# EAGLE design rev0.1 (EAGLE 8.3.1)

## Sheet 1 of 2
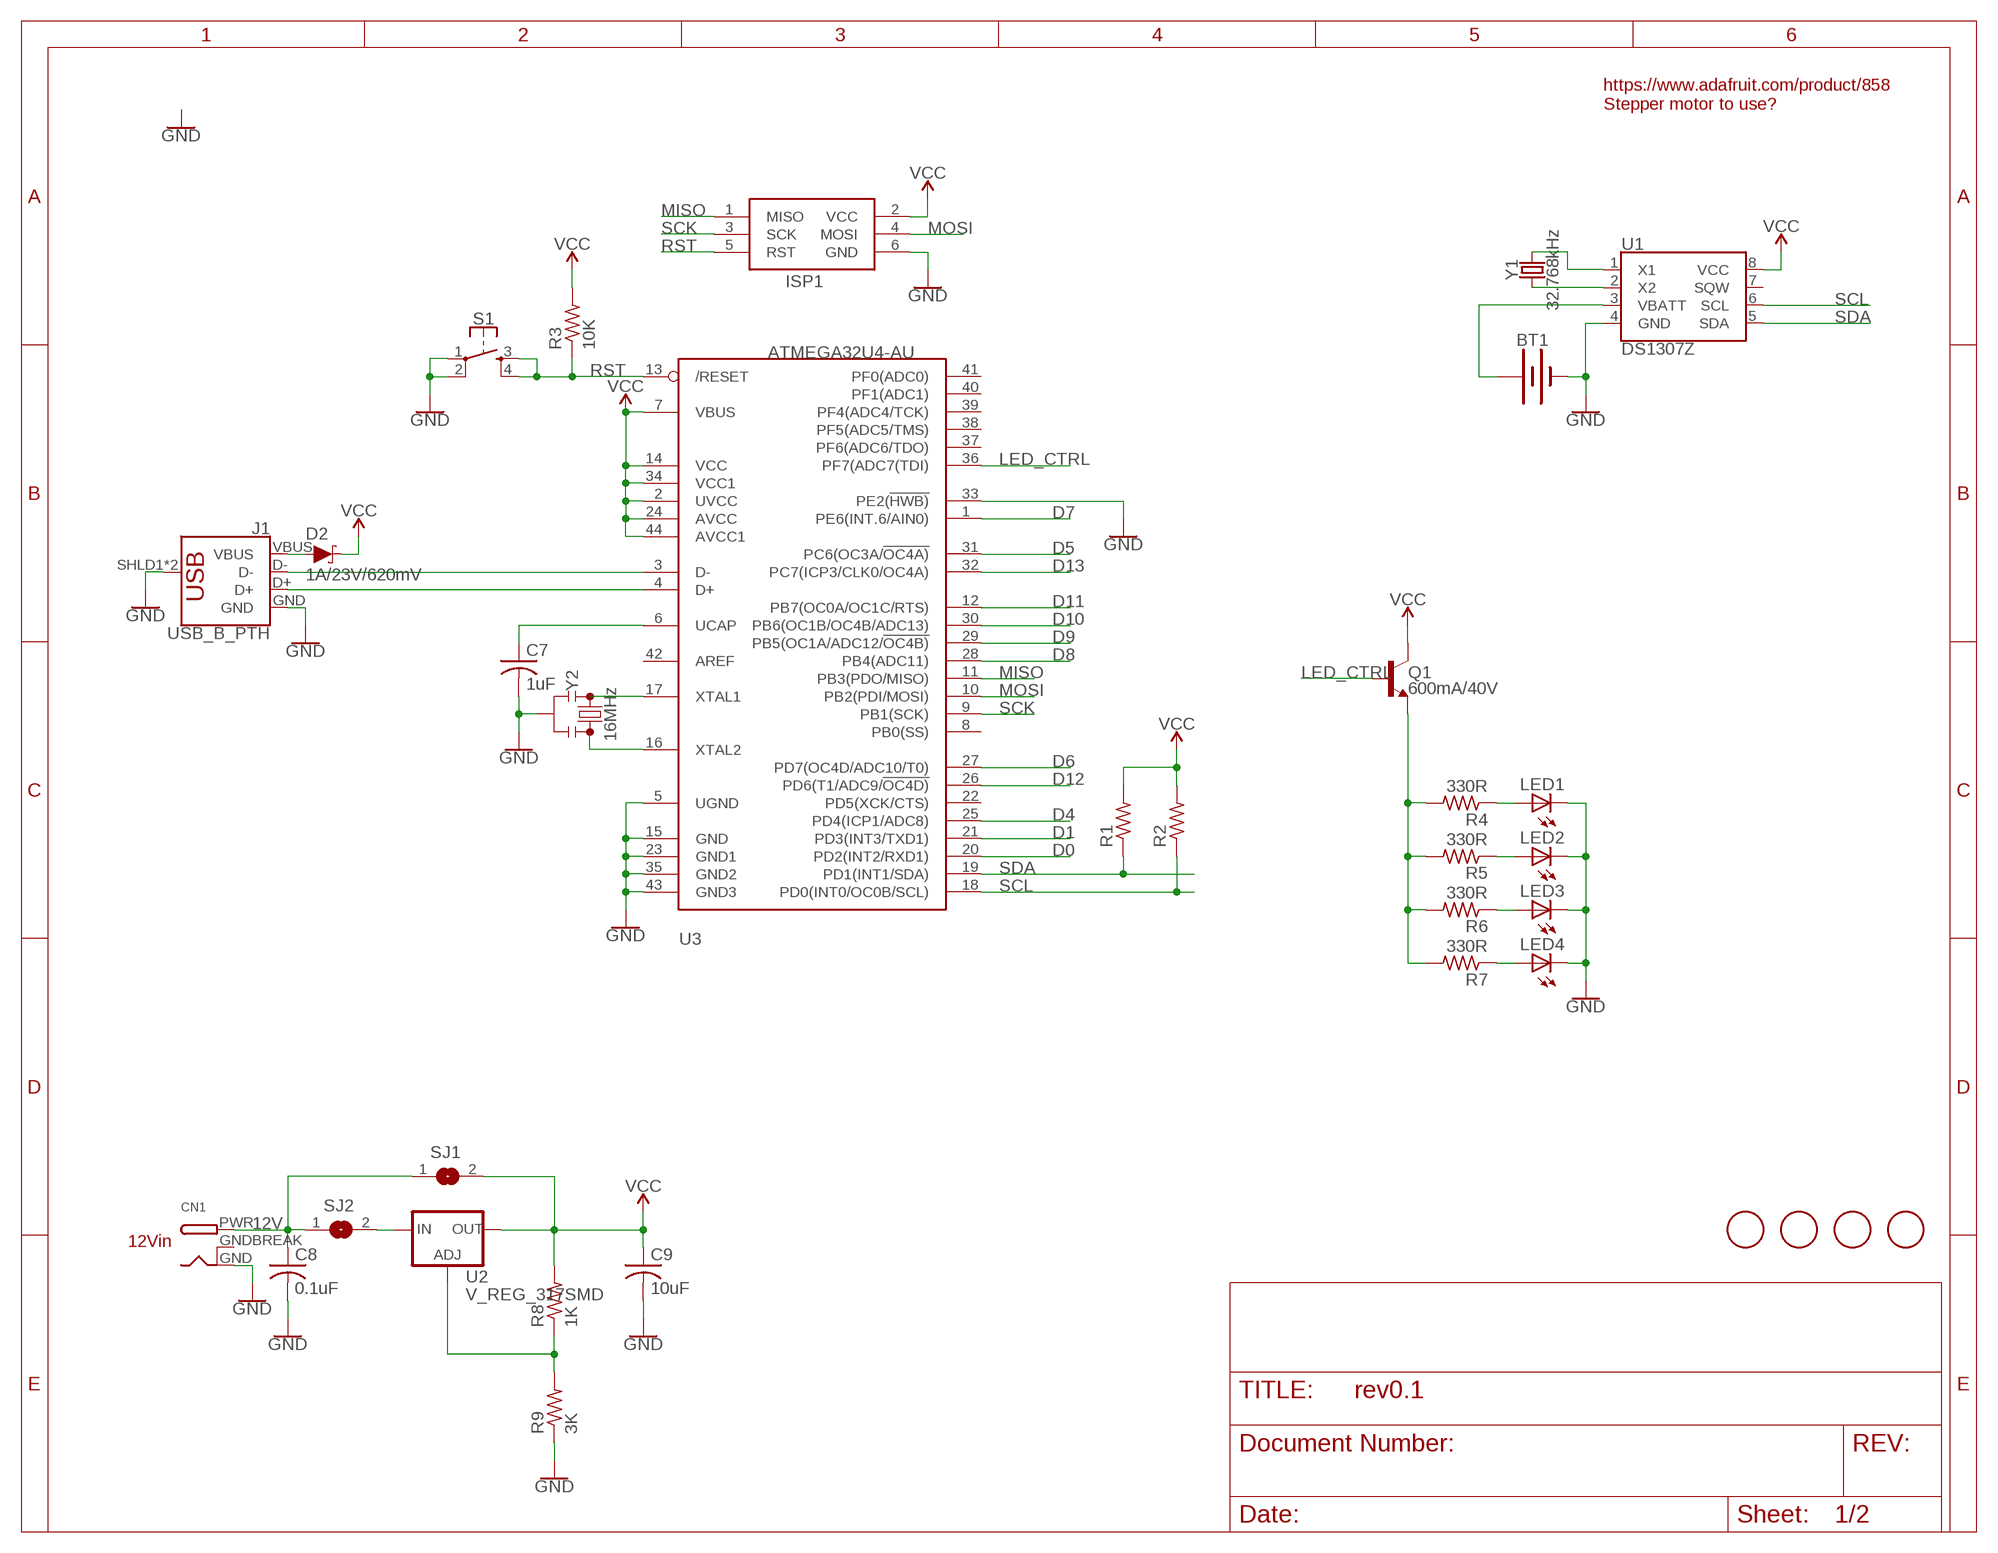
[diagram p0: schematic, sheet 1]

### Parts
BT1  BATTERY-12MM_SMD  [BATTCON_12MM]
C7  1uF  C-USC0805  [C0805]
C8  0.1uF  C-USC0805  [C0805]
C9  10uF  C-USC0805  [C0805]
CN1  DCBARRELPTH  [DCJACK_2MM_PTH]
D2  1A/23V/620mV  DIODE-SCHOTTKY-BAT20J  [SOD-323]
ISP1  AVRISP-6  [AVRISP]
J1  USB_B_PTH  [USB-B-PTH]
LED1  LEDCHIPLED_0805  [CHIPLED_0805]
LED2  LEDCHIPLED_0805  [CHIPLED_0805]
LED3  LEDCHIPLED_0805  [CHIPLED_0805]
LED4  LEDCHIPLED_0805  [CHIPLED_0805]
Q1  600mA/40V  TRANS_NPN-MMBT2222AL  [SOT23-3]
R1  R-US_R0805  [R0805]
R2  R-US_R0805  [R0805]
R3  10K  R-US_R0805  [R0805]
R4  330R  R-US_R0805  [R0805]
R5  330R  R-US_R0805  [R0805]
R6  330R  R-US_R0805  [R0805]
R7  330R  R-US_R0805  [R0805]
R8  1K  R-US_R0805  [R0805]
R9  3K  R-US_R0805  [R0805]
S1  MOMENTARY-SWITCH-SPST-2-SMD-5.2MM  [TACTILE_SWITCH_SMD_5.2MM]
SJ1  SJ  [SJ]
SJ2  SJ  [SJ]
U1  DS1307Z  [SO08-0.15]
U2  V_REG_317SMD  [SOT223]
U3  ATMEGA32U4-AU  [TQFP44]
U$2  FIDUCIAL  [FIDUCIAL_1MM]
U$3  FIDUCIAL  [FIDUCIAL_1MM]
U$4  FIDUCIAL  [FIDUCIAL_1MM]
U$5  FIDUCIAL  [FIDUCIAL_1MM]
Y1  32.768kHz  CRYSTAL-32.768KHZPTH-2X6-KIT  [CRYSTAL-PTH-2X6-CYL-KIT]
Y2  16MHz  RESONATOR-16MHZSMD_3.2X1.3  [RESONATOR-SMD-3.2X1.3]

### Nets
12V: C8.1 CN1.PWR SJ1.1 SJ2.1 ; also sheet 2
D0: U3.20(PD2(INT2/RXD1)) ; also sheet 2
D1: U3.21(PD3(INT3/TXD1)) ; also sheet 2
D4: U3.25(PD4(ICP1/ADC8)) ; also sheet 2
D5: U3.31(PC6(OC3A/!OC4A)) ; also sheet 2
D6: U3.27(PD7(OC4D/ADC10/T0)) ; also sheet 2
D7: U3.1(PE6(INT.6/AIN0)) ; also sheet 2
D8: U3.28(PB4(ADC11)) ; also sheet 2
D9: U3.29(PB5(OC1A/ADC12/!OC4B)) ; also sheet 2
D10: U3.30(PB6(OC1B/OC4B/ADC13)) ; also sheet 2
D11: U3.12(PB7(OC0A/OC1C/RTS)) ; also sheet 2
D12: U3.26(PD6(T1/ADC9/!OC4D)) ; also sheet 2
D13: U3.32(PC7(ICP3/CLK0/OC4A)) ; also sheet 2
D_N: J1.D- U3.3(D-)
D_P: J1.D+ U3.4(D+)
GND: BT1.GND(-) C7.2 C8.2 C9.2 CN1.GND ISP1.6(GND) J1.GND J1.SHLD1(SHIELD) J1.SHLD2(SHIELD) LED1.C LED2.C LED3.C LED4.C R9.1 S1.1 S1.2 U1.4(GND) U3.5(UGND) U3.15(GND) U3.23(GND1) U3.33(PE2(!HWB)) U3.35(GND2) U3.43(GND3) Y2.2 ; also sheet 2
LED_CTRL: Q1.1(B) U3.36(PF7(ADC7(TDI))
MISO: ISP1.1(MISO) U3.11(PB3(PDO/MISO))
MOSI: ISP1.4(MOSI) U3.10(PB2(PDI/MOSI))
N$1: U1.2(X2) Y1.1
N$2: U1.1(X1) Y1.2
N$3: BT1.PWR@1(+) U1.3(VBATT)
N$4: U3.16(XTAL2) Y2.3
N$5: Q1.2(E) R4.2 R5.2 R6.2 R7.2
N$6: U3.17(XTAL1) Y2.1
N$7: D2.A J1.VBUS
N$8: C7.1 U3.6(UCAP)
N$9: LED1.A R4.1
N$10: LED2.A R5.1
N$11: LED3.A R6.1
N$12: LED4.A R7.1
N$13: SJ2.2 U2.3(IN)
N$27: R8.1 R9.2 U2.1(ADJ)
RST: ISP1.5(RST) R3.1 S1.3 S1.4 U3.13(/RESET)
SCK: ISP1.3(SCK) U3.9(PB1(SCK))
SCL: R2.1 U1.6(SCL) U3.18(PD0(INT0/OC0B/SCL))
SDA: R1.1 U1.5(SDA) U3.19(PD1(INT1/SDA))
VCC: C9.1 D2.C ISP1.2(VCC) Q1.3(C) R1.2 R2.2 R3.2 R8.2 SJ1.2 U1.8(VCC) U2.2(OUT) U3.2(UVCC) U3.7(VBUS) U3.14(VCC) U3.24(AVCC) U3.34(VCC1) U3.44(AVCC1) ; also sheet 2
Unconnected: U1.7(SQW) U3.8(PB0(SS)) U3.22(PD5(XCK/CTS)) U3.37(PF6(ADC6/TDO)) U3.38(PF5(ADC5/TMS)) U3.39(PF4(ADC4/TCK)) U3.40(PF1(ADC1)) U3.41(PF0(ADC0)) U3.42(AREF)

### Notes on the sheet
- https://www.adafruit.com/product/858 
  Stepper motor to use?
- 12Vin

## Sheet 2 of 2
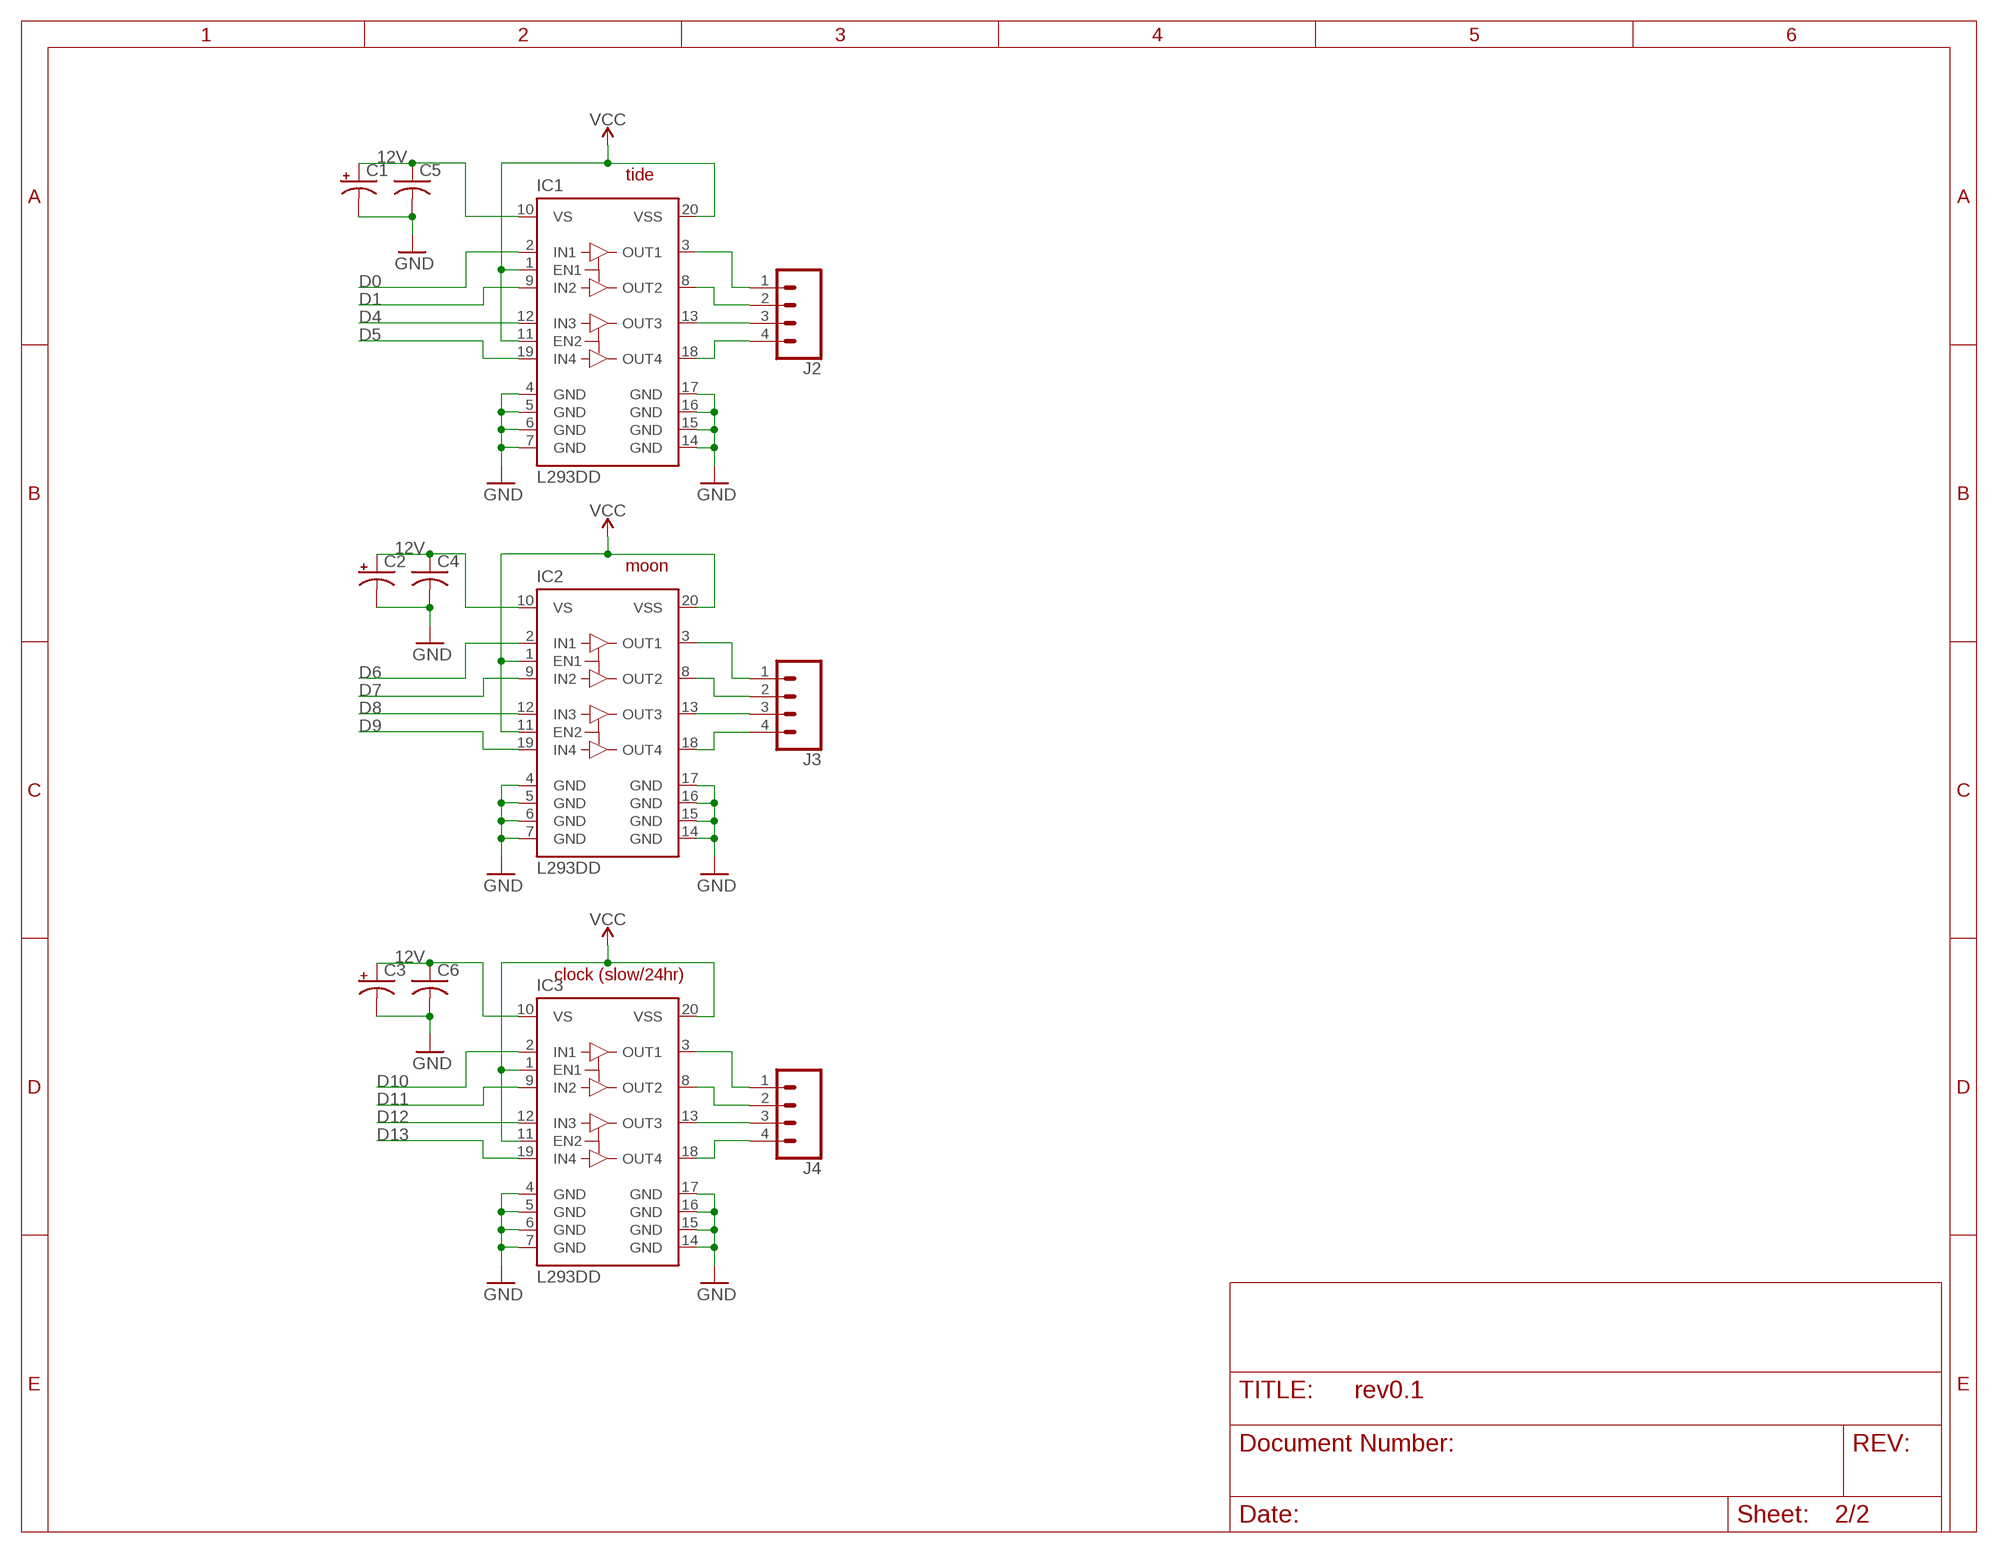
[diagram p1: schematic, sheet 2]

### Parts
C1  CPOL-USD  [PANASONIC_D]
C2  CPOL-USD  [PANASONIC_D]
C3  CPOL-USD  [PANASONIC_D]
C4  C-USC0805  [C0805]
C5  C-USC0805  [C0805]
C6  C-USC0805  [C0805]
IC1  L293DD  [SO20]
IC2  L293DD  [SO20]
IC3  L293DD  [SO20]
J2  CONN_04LOCK  [1X04_LOCK]
J3  CONN_04LOCK  [1X04_LOCK]
J4  CONN_04LOCK  [1X04_LOCK]

### Nets
12V: C1.+ C2.+ C3.+ C4.1 C5.1 C6.1 IC1.10(VS) IC2.10(VS) IC3.10(VS) ; also sheet 1
D0: IC1.2(IN1) ; also sheet 1
D1: IC1.9(IN2) ; also sheet 1
D4: IC1.12(IN3) ; also sheet 1
D5: IC1.19(IN4) ; also sheet 1
D6: IC2.2(IN1) ; also sheet 1
D7: IC2.9(IN2) ; also sheet 1
D8: IC2.12(IN3) ; also sheet 1
D9: IC2.19(IN4) ; also sheet 1
D10: IC3.2(IN1) ; also sheet 1
D11: IC3.9(IN2) ; also sheet 1
D12: IC3.12(IN3) ; also sheet 1
D13: IC3.19(IN4) ; also sheet 1
GND: C1.- C2.- C3.- C4.2 C5.2 C6.2 IC1.4(GND) IC1.5(GND) IC1.6(GND) IC1.7(GND) IC1.14(GND) IC1.15(GND) IC1.16(GND) IC1.17(GND) IC2.4(GND) IC2.5(GND) IC2.6(GND) IC2.7(GND) IC2.14(GND) IC2.15(GND) IC2.16(GND) IC2.17(GND) IC3.4(GND) IC3.5(GND) IC3.6(GND) IC3.7(GND) IC3.14(GND) IC3.15(GND) IC3.16(GND) IC3.17(GND) ; also sheet 1
N$14: IC3.3(OUT1) J4.1
N$15: IC3.8(OUT2) J4.2
N$16: IC3.13(OUT3) J4.3
N$17: IC3.18(OUT4) J4.4
N$18: IC2.18(OUT4) J3.4
N$19: IC2.13(OUT3) J3.3
N$20: IC2.8(OUT2) J3.2
N$21: IC2.3(OUT1) J3.1
N$22: IC1.3(OUT1) J2.1
N$23: IC1.8(OUT2) J2.2
N$24: IC1.13(OUT3) J2.3
N$25: IC1.18(OUT4) J2.4
VCC: IC1.1(EN1) IC1.11(EN2) IC1.20(VSS) IC2.1(EN1) IC2.11(EN2) IC2.20(VSS) IC3.1(EN1) IC3.11(EN2) IC3.20(VSS) ; also sheet 1

### Notes on the sheet
- tide
- moon
- clock (slow/24hr)

## Power pins joined to a net without a drawn wire
GNDBREAK: CN1.GNDBREAK

## Library data of the parts
BT1 = SparkFun-Batteries:BATTERY: Battery - Single Cell A variety of battery chemistries, sizes, and footprints. Device List: 20MM_PTH - Coin Cell Battery Holder - 20mm (PTH) <https://www.sparkfun.com/products/783> 6.8MM_PTH - Coin Cell Battery Holder - 6.8MM(SMD) <https://www.digikey.com/product-detail/en/seiko-instruments/MS621FE-FL11E/728-1057-ND/1889208?WT.srch=1&gclid=CNOQ5a6LzdQCFZS2wAodXCkE0g> 12MM_SMD - Coin Cell Battery Holder - 12mm (SMD) <https://www.sparkfun.com/products/10592> 12MM_PTH - Coin Cell Battery Holder - 12mm (PTH) <https://www.sparkfun.com/products/7948> 20MM_SMD - 20mm Coin Cell Battery Holder (SMD) (2 legs) Used on the Big Time Watch Kit <https://www.sparkfun.com/products/11734> 20MM_SMD_4LEGS - Coin Cell Battery Holder - 20mm (SMD) <https://www.sparkfun.com/products/11892> 20MM_SMD_4LEGS_OVERPASTE - Coin Cell Battery Holder - 20mm (SMD) <https://www.sparkfun.com/products/11892> (Over-paste on the legs) 24.5MM_PTH - Coin Cell Battery Holder - 24.5mm (PTH) <https://www.sparkfun.com/products/8863> 9V - 9V Battery Holder - PC Mount Used on the SparkFun SparkPunk Sound Kit <https://www.sparkfun.com/products/11177> and SparkFun SparkPunk Sequencer Kit <https://www.sparkfun.com/products/12707> 18650 - Battery Holder - 18650 (PTH) <https://www.sparkfun.com/products/13113> AA - Battery Holder - 1xAA (PTH) <https://www.sparkfun.com/products/7949> AAA - Battery Holder - 1xAAA (PTH) <https://www.sparkfun.com/products/12718> AA_KIT - Battery Holder - 1xAA (PTH) <https://www.sparkfun.com/products/7949> Special kit package - pads only have exposed copper on one side of the board. AAA_KIT - Battery Holder - 1xAAA (PTH) <https://www.sparkfun.com/products/12718> Special kit package - pads only have exposed copper on one side of the board.; PROD_ID: BATT-08044; SF_SKU: PRT-10592
C1-C3 = resistor:CPOL-US: POLARIZED CAPACITOR, American symbol
C4-C9 = resistor:C-US: CAPACITOR, American symbol
CN1 = adafruit:DCBARREL: 2.0mm DC Barrel Jack DCJACK_2MM_PTH - Through Hole Jack (4UConnector: 05537)
D2 = SparkFun-DiscreteSemi:DIODE-SCHOTTKY: Schottky diode A Schottky diode is a semiconductor diode which has a low forward voltage drop and a very fast switching action.; PROD_ID: DIO-11623
IC1-IC3 = st-microelectronics:L293DD: PUSH-PULL FOUR CHANNEL DRIVER WITH DIODES Source: http://www.st.com/stonline/books/pdf/docs/1330.pdf; OC_FARNELL: unknown
ISP1 = adafruit:AVRISP: AVR ISP HEADER Standard 6 pin header for AVR programming
J1 = SparkFun-Connectors:USB_B: USB Type B Connector SparkFun Products: SparkFun Stepoko <https://www.sparkfun.com/products/13899> PTH; PROD_ID: CONN-08278; SF_ID: PRT-00139
J2-J4 = SparkFun-Connectors:CONN_04: Multi connection point. Often used as Generic Header-pin footprint for 0.1 inch spaced/style header connections On any of the 0.1 inch spaced packages, you can populate with these: Break Away Headers - Straight <https://www.sparkfun.com/products/116> (PRT-00116) Break Away Male Headers - Right Angle <https://www.sparkfun.com/products/553> (PRT-00553) Female Headers <https://www.sparkfun.com/products/115> (PRT-00115) Break Away Headers - Machine Pin <https://www.sparkfun.com/products/117> (PRT-00117) Break Away Female Headers - Swiss Machine Pin <https://www.sparkfun.com/products/743> (PRT-00743) For SCREWTERMINALS and SPRING TERMINALS visit here: Screw Terimnals on SparkFun.com <https://www.sparkfun.com/search/results?term=Screw+Terminals> (5mm/3.5mm/2.54mm spacing) This device is also useful as a general connection point to wire up your design to another part of your project. Our various solder wires solder well into these plated through hole pads. Hook-Up Wire - Assortment (Stranded, 22 AWG) <https://www.sparkfun.com/products/11375> (PRT-11375) Hook-Up Wire - Assortment (Solid Core, 22 AWG) <https://www.sparkfun.com/products/11367> (PRT-11367) View the entire wire category on our website here <https://www.sparkfun.com/categories/141> Special notes: Molex polarized connector foot print use with SKU : PRT-08231 with associated crimp pins and housings. 1MM SMD Version SKU: PRT-10208; PROD_ID: CONN-09696
LED1-LED4 = adafruit:LED: LED OSRAM: - CHIPLED LG R971, LG N971, LY N971, LG Q971, LY Q971, LO R971, LY R971 LH N974, LH R974 LS Q976, LO Q976, LY Q976 LO Q996 - Hyper CHIPLED LW Q18S LB Q993, LB Q99A, LB R99A - SideLED LS A670, LO A670, LY A670, LG A670, LP A670 LB A673, LV A673, LT A673, LW A673 LH A674 LY A675 LS A676, LA A676, LO A676, LY A676, LW A676 LS A679, LY A679, LG A679 - Hyper Micro SIDELED® LS Y876, LA Y876, LO Y876, LY Y876 LT Y87S - SmartLED LW L88C, LW L88S LB L89C, LB L89S, LG L890 LS L89K, LO L89K, LY L89K LS L896, LA L896, LO L896, LY L896 - TOPLED LS T670, LO T670, LY T670, LG T670, LP T670 LSG T670, LSP T670, LSY T670, LOP T670, LYG T670 LG T671, LOG T671, LSG T671 LB T673, LV T673, LT T673, LW T673 LH T674 LS T676, LA T676, LO T676, LY T676, LB T676, LH T676, LSB T676, LW T676 LB T67C, LV T67C, LT T67C, LS T67K, LO T67K, LY T67K, LW E67C LS E67B, LA E67B, LO E67B, LY E67B, LB E67C, LV E67C, LT E67C LW T67C LS T679, LY T679, LG T679 LS T770, LO T770, LY T770, LG T770, LP T770 LB T773, LV T773, LT T773, LW T773 LH T774 LS E675, LA E675, LY E675, LS T675 LS T776, LA T776, LO T776, LY T776, LB T776 LHGB T686 LT T68C, LB T68C - Hyper Mini TOPLED® LB M676 - Mini TOPLED Santana® LG M470 LS M47K, LO M47K, LY M47K Source: http://www.osram.convergy.de/
Q1 = SparkFun-DiscreteSemi:TRANS_NPN: NPN transistor Current controlled devices typically used to amplify current or used as a switch. BC547 - COM-08928 <http://www.sparkfun.com/products/8928> (TO-92 45V 100mA) (1.Collector 2.Base 3.Emitter) 2N3904 - COM-00521 <http://www.sparkfun.com/products/521> (TO-92 40V 200mA) (1.Emitter 2.Base 3.Collector) P2N2222A - COM-12852 <http://www.sparkfun.com/products/12852> (TO-92 40V 600mA) (1.Collector 2.Base 3.Emitter); PROD_ID: TRANS-08049
R1-R9 = resistor:R-US_: RESISTOR, American symbol
S1 = SparkFun-Switches:MOMENTARY-SWITCH-SPST-2: Momentary Switch (Pushbutton) - SPST - Two Circuits Normally-open (NO) SPST momentary switches (buttons, pushbuttons). Schematic symbol includes two switch circuits. Variants SMD-4.6MMX2.8MM - 4.60mm x 2.80mm Tactile Momentary Button Switch - Used on SparkFun SAMD21 Mini Breakout <https://www.sparkfun.com/products/13664> SMD-5.2MM - Mini Pushbutton Switch - SMD <https://www.sparkfun.com/products/8720> - Used on Arduino Pro Mini <https://www.sparkfun.com/products/11114>; PROD_ID: SWCH-08247; SF_SKU: COM-08720
SJ1 SJ2 = jumper:SJ: SMD solder JUMPER
U1 = SparkFun-Clocks:DS1307: Maxim DS1307 - I2C Real-time clock (RTC) The DS1307 serial real-time clock (RTC) is a low-power, full binary-coded decimal (BCD) clock/calendar plus 56 bytes of NV SRAM. Address and data are transferred serially through an I2C, bidirectional bus. The clock/calendar provides seconds, minutes, hours, day, date, month, and year information. SparkFun Products: Real Time Clock Module <https://www.sparkfun.com/products/12708> (BOB-12708) Datasheet <https://cdn.sparkfun.com/datasheets/BreakoutBoards/DS1307.pdf>; PROD_ID: IC-08138
U2 = SparkFun-IC-Power:V_REG_317: Voltage Regulator Standard LM317 adjustable voltage regulator. AOI (Adjust Output Input). Google 'LM317 Calculator' for easy to use app to get the two resistor values needed. 240/720 for 5V output. 240/390 for 3.3V output. Spark Fun Electronics SKU : COM-00527
U3 = adafruit:ATMEGA32U4: http://www.ladyada.net/library/eagle
U$2-U$5 = adafruit:FIDUCIAL: For use by pick and place machines to calibrate the vision/machine, 1mm By microbuilder.eu
Y1 = SparkFun-Clocks:CRYSTAL-32.768KHZ: 32.768kHz Crystal Frequency: 32.768kHz Frequency Stability: ±20ppm Load Capacitance: 12.5pF (PTH-2X6 & SMD-3.2X1.5), 6pF (SMD-2X6) SparkFun Products: SparkFun BigTime Watch Kit <https://www.sparkfun.com/products/11734> SparkFun nRF52832 Breakout <https://www.sparkfun.com/products/13990> SparkFun Real Time Clock Module <https://www.sparkfun.com/products/12708>; PROD_ID: XTAL-10112
Y2 = SparkFun-Clocks:RESONATOR-16MHZ: 16MHz Resonator Digikey Example <http://www.digikey.com/product-detail/en/murata-electronics-north-america/CSTCE16M0V53-R0/490-1198-1-ND/584635> Frequency: 16MHz Frequency Stability: ±0.3% Frequency Tolerance: ±0.5% Capacitance: 15pF SparkFun Products SparkFun OpenLog <https://www.sparkfun.com/products/13712> SparkFun MicroView - OLED Arduino Module <https://www.sparkfun.com/products/12923>; PROD_ID: XTAL-08900

## Board
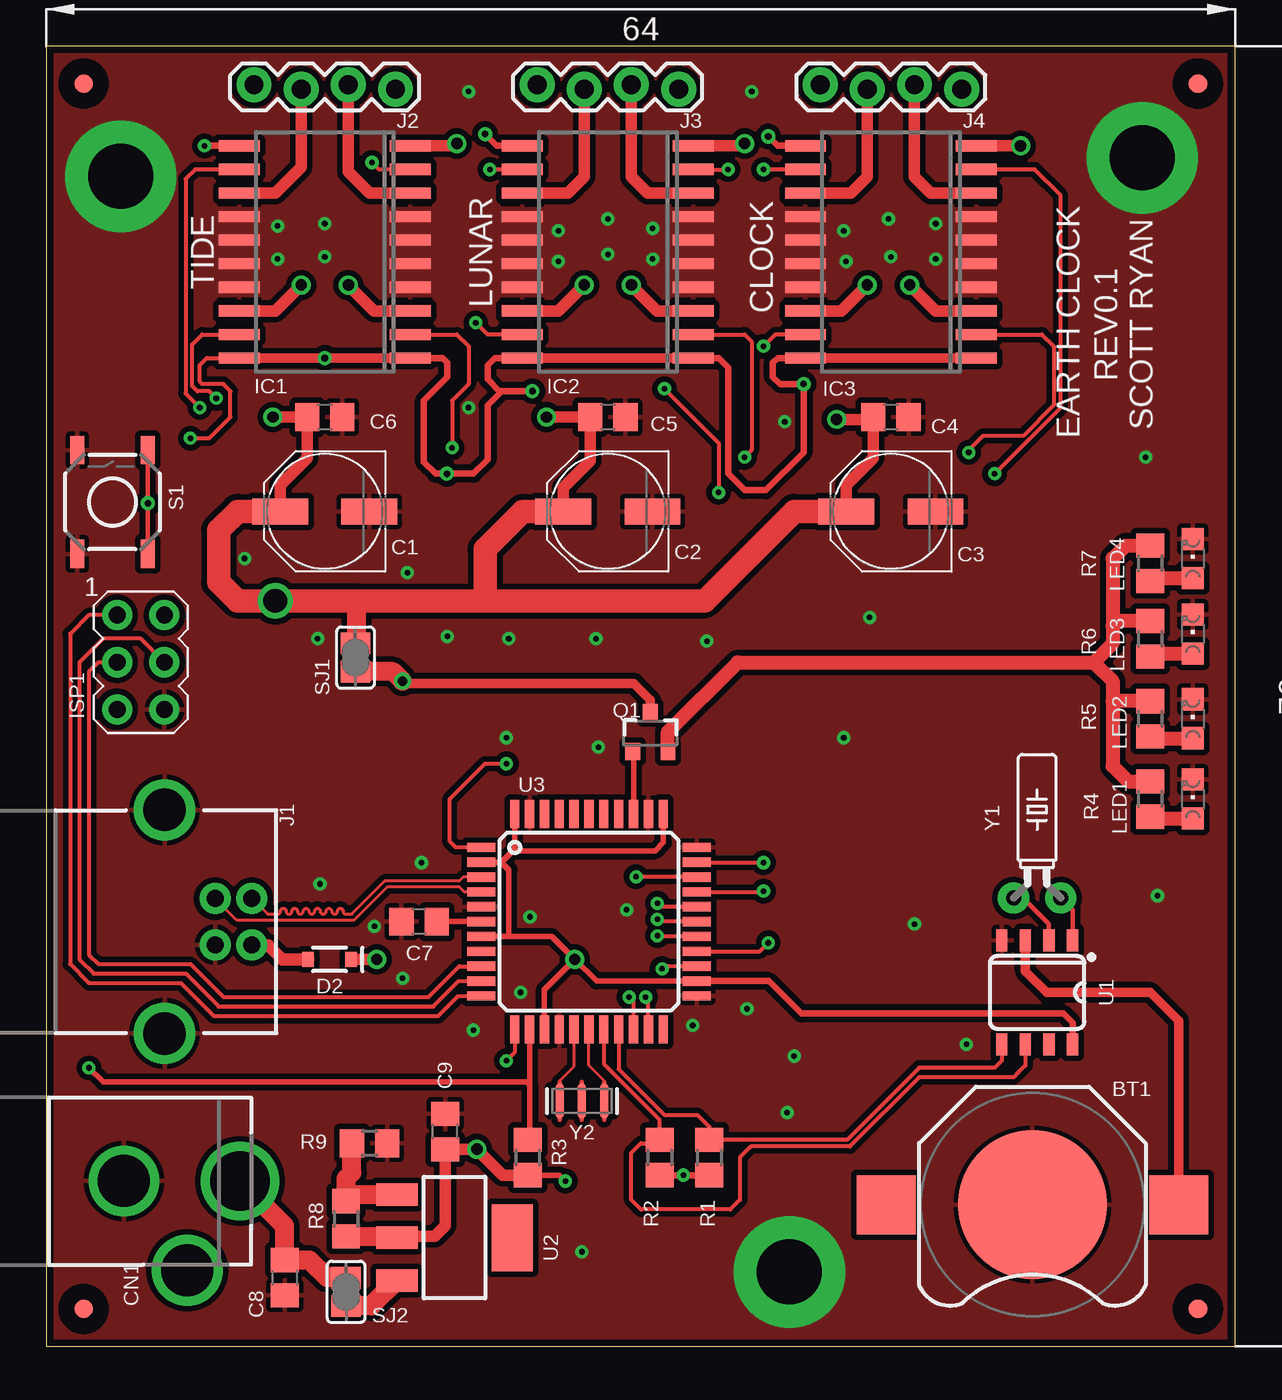
[diagram p2: board, top side]
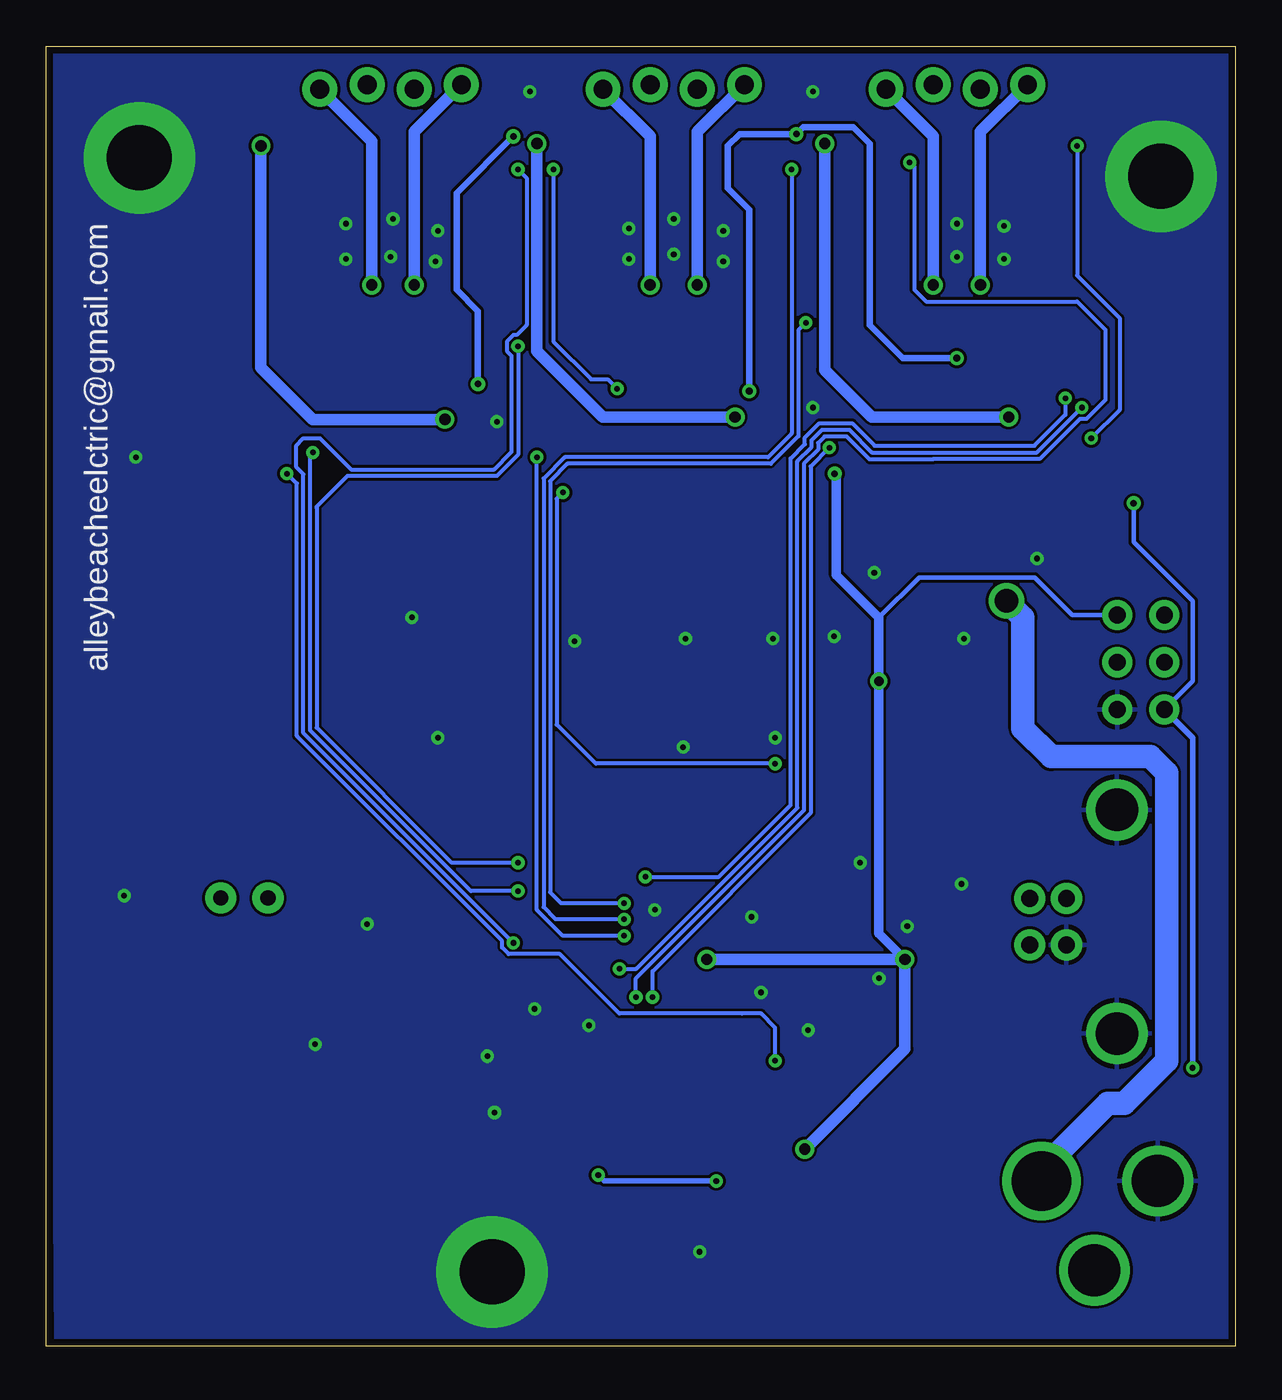
[diagram p3: board, bottom side, seen from below]

Size 64 x 70 mm. Coordinates in mm from the lower left corner, seen from the top.
Outline: 0,0 64,0 64,70 0,70 0,0
Copper layers (1*16): Top 0.035mm / dielectric 1.5mm / Bottom 0.035mm
Design rules "default *": minimum track width 6mil, minimum drill 0.3mm, track to track 6mil, track to pad 6mil, pad to pad 6mil, via to via 6mil, smd to smd 6mil, copper to edge 15mil, drill to drill 6mil, minimum pad ring 10mil, minimum via ring 8mil, stop-mask expansion 4mil, vias tented up to drill 0mil, thermal gap 10mil

### Footprints (pad centres in the part's own frame; a part is rotated, then mirrored left to right if it is on the bottom)
BATTCON_12MM = smd 8 x 8: GND 0,0 | smd 3.175 x 3.175: PWR@1 -7.874,0; PWR@2 7.874,0
PANASONIC_D = smd 3 x 1.4: + 2.4,0; - -2.4,0
C0805 = smd 1.3 x 1.5: 1 -0.95,0; 2 0.95,0
DCJACK_2MM_PTH = drill 2.8: GND 0,7.35; GNDBREAK 4.8,10.75 | drill 3.2: PWR 0,13.6
SOD-323 = smd 0.63 x 0.83: A 1.15,0; C -1.15,0
SO20 = smd 0.6 x 2.2: 1 -5.715,-4.6; 2 -4.445,-4.6; 3 -3.175,-4.6; 4 -1.905,-4.6; 5 -0.635,-4.6; 6 0.635,-4.6; 7 1.905,-4.6; 8 3.175,-4.6; 9 4.445,-4.6; 10 5.715,-4.6; 11 5.715,4.6; 12 4.445,4.6; 13 3.175,4.6; 14 1.905,4.6; 15 0.635,4.6; 16 -0.635,4.6; 17 -1.905,4.6; 18 -3.175,4.6; 19 -4.445,4.6; 20 -5.715,4.6
AVRISP = drill 0.9 pad 1.626: 1 -1.27,2.54; 2 1.27,2.54; 3 -1.27,0; 4 1.27,0; 5 -1.27,-2.54; 6 1.27,-2.54
USB-B-PTH = drill 0.914 pad 1.676: D+ 4,1.25; D- 5.981,1.25; GND 4,-1.25; VBUS 5.981,-1.25 | drill 2.286: SHLD1 1.282,-6.02; SHLD2 1.282,6.02
1X04_LOCK = drill 1.016 pad 1.88: 1 0,0.127; 2 2.54,-0.127; 3 5.08,0.127; 4 7.62,-0.127
CHIPLED_0805 = smd 1.2 x 1.2: A 0,-1.05; C 0,1.05
SOT23-3 = smd 0.8 x 0.9: 1 -0.95,-1; 2 0.95,-1; 3 0,1.1
R0805 = smd 1.3 x 1.5: 1 -0.95,0; 2 0.95,0
TACTILE_SWITCH_SMD_5.2MM = smd 1.524 x 0.762: 1 -2.794,1.905; 2 2.794,1.905; 3 -2.794,-1.905; 4 2.794,-1.905
SJ = smd 1.168 x 1.6: 1 -0.762,0; 2 0.762,0
SO08-0.15 = smd 0.6 x 1.2: 1 -1.905,-2.8; 2 -0.635,-2.8; 3 0.635,-2.8; 4 1.905,-2.8; 5 1.905,2.8; 6 0.635,2.8; 7 -0.635,2.8; 8 -1.905,2.8
SOT223 = smd 1.219 x 2.235: 1 -2.311,-3.099; 2 0,-3.099; 3 2.311,-3.099 | smd 3.6 x 2.2: 4 0,3.099
TQFP44 = smd 1.5 x 0.5: 1 -5.8,4; 2 -5.8,3.2; 3 -5.8,2.4; 4 -5.8,1.6; 5 -5.8,0.8; 6 -5.8,0; 7 -5.8,-0.8; 8 -5.8,-1.6; 9 -5.8,-2.4; 10 -5.8,-3.2; 11 -5.8,-4; 23 5.8,-4; 24 5.8,-3.2; 25 5.8,-2.4; 26 5.8,-1.6; 27 5.8,-0.8; 28 5.8,0; 29 5.8,0.8; 30 5.8,1.6; 31 5.8,2.4; 32 5.8,3.2; 33 5.8,4 | smd 0.5 x 1.5: 12 -4,-5.8; 13 -3.2,-5.8; 14 -2.4,-5.8; 15 -1.6,-5.8; 16 -0.8,-5.8; 17 0,-5.8; 18 0.8,-5.8; 19 1.6,-5.8; 20 2.4,-5.8; 21 3.2,-5.8; 22 4,-5.8; 34 4,5.8; 35 3.2,5.8; 36 2.4,5.8; 37 1.6,5.8; 38 0.8,5.8; 39 0,5.8; 40 -0.8,5.8; 41 -1.6,5.8; 42 -2.4,5.8; 43 -3.2,5.8; 44 -4,5.8
FIDUCIAL_1MM = smd 1 x 1: 1 0,0
CRYSTAL-PTH-2X6-CYL-KIT = drill 0.813 pad 1.676: 1 -1.27,0; 2 1.27,0
RESONATOR-SMD-3.2X1.3 = smd 0.45 x 1.905: 1 -1.2,0; 2 0,0; 3 1.2,0

### Placement (x,y rotation side)
BT1  53.09,7.62 180 top
C1  14.99,44.96 180 top
C2  30.23,44.96 180 top
C3  45.47,44.96 180 top
C4  45.47,50.04 0 top
C5  30.23,50.04 0 top
C6  14.99,50.04 0 top
C7  20.07,22.86 180 top
C8  12.83,3.68 270 top
C9  21.46,11.56 90 top
CN1  -3.17,8.89 270 top
D2  15.24,20.83 180 top
IC1  14.99,58.93 90 top
IC2  30.23,58.93 90 top
IC3  45.47,58.93 90 top
ISP1  5.08,36.83 0 top
J1  5.08,22.86 0 top
J2  18.8,67.82 180 top
J3  34.04,67.82 180 top
J4  49.28,67.82 180 top
LED1  61.72,29.46 0 top
LED2  61.72,33.78 0 top
LED3  61.72,38.35 0 top
LED4  61.72,42.42 0 top
Q1  32.51,33.02 0 top
R1  35.69,10.16 270 top
R2  33.02,10.16 270 top
R3  25.91,10.16 270 top
R4  59.44,29.46 90 top
R5  59.44,33.78 90 top
R6  59.44,38.1 90 top
R7  59.44,42.16 90 top
R8  16.13,6.86 270 top
R9  17.4,10.92 180 top
S1  3.56,45.47 90 top
SJ1  16.64,37.08 270 top
SJ2  16.13,2.92 270 top
U1  53.34,19.05 180 top
U2  21.97,5.84 270 top
U3  29.21,22.86 0 top
U$2  62,68 0 top
U$3  2,68 0 top
U$4  62,2 0 top
U$5  2,2 0 top
Y1  53.34,24.13 0 top
Y2  28.83,13.21 180 top

### Tracks (layer width: path | path; a pad name or v marks a point on that pad's centre or on a via)
12V  (via drill 0.61, 1.27)
  Top 0.61: v37.59,64.77 37.47,64.64 IC2.10 | v26.92,50.04 C5.1 29.28,47.69 27.83,46.24 C2.+ | v22.1,64.77 21.97,64.64 IC1.10 | v12.19,50.04 C6.1 14.04,47.82 12.59,46.37 C1.+ | C3.+ 43.07,46.37 44.52,47.82 C4.1 44.39,49.91 v42.55,49.91 | v52.45,64.64 IC3.10
  Top 1.016: SJ1.1 16.7,37.91 16.7,40.13 | SJ2.1 15.11,3.68 14.16,4.63 C8.1 12.83,6.49 CN1.PWR
  Top 1.27: 23.61,40.13 16.7,40.13 v12.32,40.13 10.29,40.13 9.27,41.15 9.27,43.94 10.29,44.96 C1.+ | 23.61,40.13 35.43,40.13 40.26,44.96 C3.+ | C2.+ 25.65,44.96 23.62,42.93 23.62,40.14 23.61,40.13
  Bottom 0.61: v37.59,64.77 37.59,53.59 34.04,50.04 v26.92,50.04 | v22.1,64.77 22.1,52.58 19.56,50.04 v12.19,50.04 | v42.55,49.91 49.66,49.91 52.45,52.7 v52.45,64.64
  Bottom 1.27: v12.32,40.13 11.43,39.24 11.43,33.27 9.91,31.75 4.57,31.75 3.68,30.86 3.68,15.37 5.97,13.08 6.87,13.08 10.43,9.53 CN1.PWR
D0  (via drill 0.3)
  Top 0.203: U3.20 31.61,18.55 v31.37,18.8 | v21.84,48.39 21.84,50.93 22.73,51.82 22.73,53.85 22.1,54.48 IC1.2
  Bottom 0.203: v31.37,18.8 31.37,20.19 22.86,28.7 22.86,47.37 v21.84,48.39
D1  (via drill 0.3)
  Top 0.203: U3.21 32.41,18.64 v32.26,18.8 | IC1.9 17.91,63.37 v17.53,63.75
  Bottom 0.203: v32.26,18.8 32.26,19.81 23.22,28.85 23.22,47.52 22.45,48.28 22.45,48.64 22.1,48.99 20.92,48.99 19.68,47.75 16.26,47.75 16.23,47.78 10.52,47.78 8.36,49.94 8,49.94 6.99,50.96 6.99,54.74 8.51,56.26 16.64,56.26 17.27,56.9 17.27,63.5 v17.53,63.75
D4  (via drill 0.3)
  Top 0.203: U3.25 33.29,20.46 v33.15,20.32 | IC1.12 8,63.37 7.49,62.87 7.49,51.31 v8.26,50.55
  Bottom 0.203: v33.15,20.32 32.25,20.32 23.57,29 23.57,47.67 22.81,48.43 22.81,48.79 22.24,49.35 20.77,49.35 19.56,48.13 10.67,48.13 v8.26,50.55
D5  (via drill 0.3)
  Top 0.203: U3.31 35,25.27 v31.75,25.27 | v9.14,51.05 8.76,51.44 8.13,51.44 7.85,51.71 7.85,53.95 8.38,54.48 IC1.19
  Bottom 0.203: v31.75,25.27 27.8,25.27 23.93,29.14 23.93,47.81 23.16,48.58 23.16,48.93 22.39,49.7 20.63,49.7 19.41,48.49 10.81,48.49 9.14,50.16 v9.14,51.05
D6  (via drill 0.3)
  Top 0.203: U3.27 32.93,22.06 v32.89,22.1 | IC2.2 37.59,54.48 37.97,54.1 37.97,48.26 v37.59,47.88
  Bottom 0.203: v32.89,22.1 36.2,22.1 37.59,23.5 v37.59,47.88
D7  (via drill 0.3)
  Top 0.203: U3.1 22.04,26.86 21.72,27.18 21.72,29.46 23.62,31.37 v24.77,31.37 | IC2.9 v36.7,63.37 | v33.27,51.56 36.2,48.64 v36.2,45.97
  Bottom 0.203: v24.77,31.37 34.42,31.37 36.52,33.48 36.52,45.64 v36.2,45.97 | v36.7,63.37 36.7,54.1 34.67,52.07 33.78,52.07 v33.27,51.56
D8  (via drill 0.3)
  Top 0.203: U3.28 33.02,22.86 v32.89,22.99 | IC2.12 v23.88,63.37
  Bottom 0.203: v32.89,22.99 36.58,22.99 37.24,23.64 37.24,46.74 36.09,47.88 25.15,47.88 23.88,49.15 v23.88,63.37
D9  (via drill 0.3)
  Top 0.203: U3.29 33.08,23.66 v32.89,23.85 | IC2.19 23.75,54.48 v23.11,55.12
  Bottom 0.203: v32.89,23.85 36.29,23.85 36.88,24.43 36.88,46.59 35.95,47.52 25,47.52 23.52,49 23.52,54.71 v23.11,55.12
D10  (via drill 0.3)
  Top 0.203: U3.30 38.56,24.46 v38.61,24.51 | IC3.2 53.59,54.48 54.23,53.85 54.23,50.67 52.58,49.02 50.42,49.02 49.66,48.26 v49.66,48.13
  Bottom 0.203: v38.61,24.51 41.15,24.51 49.81,33.17 49.81,47.98 v49.66,48.13
D11  (via drill 0.3)
  Top 0.203: U3.12 25.21,15.81 v24.77,15.37 | v51.05,46.99 54.61,50.55 54.61,61.98 53.21,63.37 IC3.9
  Bottom 0.203: v24.77,15.37 24.77,17.14 25.53,17.91 26.54,17.91 33.15,17.91 36.35,21.11 39.11,21.11 39.47,21.46 39.47,21.82 50.52,32.87 50.52,46.46 v51.05,46.99
D12  (via drill 0.3)
  Top 0.203: U3.26 38.41,21.26 v38.86,21.72 | IC3.12 v38.61,63.37
  Bottom 0.203: v38.86,21.72 50.16,33.02 50.16,46.96 50.55,47.34 50.55,48.51 50.16,48.9 49.28,48.9 47.6,47.22 39.9,47.22 38.96,48.15 38.96,53.34 39.22,53.6 39.22,54.1 38.86,54.45 38.69,54.45 38.15,54.99 38.15,62.92 v38.61,63.37
D13  (via drill 0.3)
  Top 0.203: U3.32 38.58,26.06 v38.61,26.04 | IC3.19 39.24,54.48 v38.61,53.85
  Bottom 0.203: v38.61,26.04 42.17,26.04 49.45,33.31 49.45,45.14 | 49.45,45.14 49.45,45.21 | v38.61,53.85 38.61,48.01 39.75,46.86 47.8,46.86 49.45,45.21 | 49.45,45.21 49.45,45.14
D_N
  Top 0.152: U3.3 22.44,25.26 22.23,25.04 18.23,25.04 16.45,23.27 16.13,23.27 arc-90 15.98,23.42 15.98,23.42 arc90 15.82,23.57 15.82,23.57 arc90 15.67,23.42 15.67,23.42 arc-90 15.52,23.27 15.52,23.27 arc-90 15.36,23.42 15.36,23.42 arc90 15.21,23.57 15.21,23.57 arc90 15.05,23.42 15.05,23.42 arc-90 14.9,23.27 14.9,23.27 arc-90 14.75,23.42 14.75,23.42 arc90 14.6,23.57 14.59,23.57 arc90 14.44,23.42 14.44,23.42 arc-90 14.29,23.27 14.29,23.27 arc-90 14.13,23.42 14.13,23.42 arc90 13.98,23.57 13.98,23.57 arc90 13.83,23.42 13.83,23.42 arc-90 13.68,23.27 13.67,23.27 arc-90 13.52,23.42 13.52,23.42 arc90 13.37,23.57 13.37,23.57 arc90 13.21,23.42 13.21,23.42 arc-90 13.06,23.27 13.06,23.27 arc-90 12.91,23.42 12.91,23.42 arc90 12.75,23.57 12.75,23.57 arc90 12.6,23.42 12.6,23.42 arc-90 12.45,23.27 11.9,23.27 J1.D-
D_P
  Top 0.152: U3.4 22.5,24.46 22.23,24.74 18.35,24.74 16.57,22.96 10.23,22.96 J1.D+
GND  (via drill 0.3, 3.5 pad 6)
  other vias: 42.93,32.77 25.53,19.05 26.04,23.11 31.24,23.5 24.77,32.77 29.72,32.26 35.56,37.97 29.59,38.1 24.89,38.1 21.59,38.23 14.61,38.1 10.67,42.42 19.43,41.66 12.45,60.33 12.45,58.55 14.99,58.67 14.99,60.45 27.56,60.07 27.56,58.42 32.64,60.2 32.64,58.55 42.93,60.07 43.05,58.42 47.88,60.45 47.88,58.55 45.34,60.71 45.47,58.67 30.23,60.71 30.23,58.8 37.97,67.56 22.73,67.56 44.32,39.24 46.74,22.73 59.18,47.88 59.82,24.26 28.83,5.08 14.73,24.89 20.19,26.04 17.65,22.61 19.18,19.81 22.99,17.02 49.53,16.26 37.72,18.16 34.8,17.27 39.88,12.57 40.26,15.62 40,4 59,64 4,63 39.75,49.78 22.73,50.55
  pour Top (isolate 0.305): 0,0 0,69.85 63.5,69.85 63.5,0
  pour Bottom: 63.5,0 64.01,69.85 0,69.85 0,0
  pour Top (isolate 0.406, rank 2, no thermals): 51.56,56.64 51.56,61.47 8.89,61.47 8.89,56.64
LED_CTRL
  Top 0.305: U3.36 31.61,31.97 Q1.1
MISO
  Top 0.203: ISP1.1 2.29,39.37 1.27,38.35 1.27,20.57 2.29,19.56 7.24,19.56 9.02,17.78 21.08,17.78 22.16,18.86 U3.11
MOSI
  Top 0.203: ISP1.4 5.08,38.1 3.05,38.1 1.78,36.83 1.78,20.83 2.54,20.07 7.49,20.07 9.27,18.29 20.83,18.29 22.2,19.66 U3.10
N$1
  Top 0.254: U1.2 53.98,22.73 52.58,24.13 Y1.1
N$2
  Top 0.254: U1.1 55.24,23.5 Y1.2
N$3
  Top 0.508: BT1.PWR@1 60.96,17.53 59.44,19.05 53.85,19.05 52.7,20.19 U1.3
N$4
  Top 0.152: Y2.3 27.63,14.29 28.41,15.07 U3.16
N$5
  Top 0.762: 57.4,38.79 57.4,42.42 58.1,43.11 R7.2 | R4.2 58.23,30.41 57.4,31.24 57.4,34.74 | R6.2 57.67,39.05 57.4,38.79 | R5.2 57.42,34.73 57.4,34.74 | 57.4,38.79 57.4,37.85 56.39,36.83 | 56.39,36.83 57.4,35.81 57.4,34.74 | Q1.2 33.46,33.08 37.21,36.83 56.39,36.83
N$6
  Top 0.152: Y2.1 30.03,14.29 29.21,15.11 U3.17
N$7
  Top 0.66: D2.A 12.7,20.83 11.94,21.59 11.08,21.59 J1.VBUS
N$8
  Top 0.305: U3.6 C7.1
N$9
  Top 0.762: R4.1 59.54,28.41 LED1.A
N$10
  Top 0.762: R5.1 59.54,32.73 LED2.A
N$11
  Top 0.762: R6.1 59.59,37.3 LED3.A
N$12
  Top 0.762: R7.1 59.59,41.37 LED4.A
N$13
  Top 1.016: U2.3 17.5,2.16 SJ2.2
N$14  (via drill 0.61)
  Top 0.61: v46.48,57.15 47.88,55.75 IC3.3
  Bottom 0.61: J4.1 46.48,64.9 v46.48,57.15
N$15
  Top 0.61: J4.2 46.74,62.99 47.62,62.1 IC3.8
N$16
  Top 0.61: J4.3 44.2,62.99 43.31,62.1 IC3.13
N$17  (via drill 0.61)
  Top 0.61: v44.2,57.15 42.8,55.75 IC3.18
  Bottom 0.61: J4.4 44.2,65.41 v44.2,57.15
N$18  (via drill 0.61)
  Top 0.61: IC2.18 27.56,55.75 v28.96,57.15
  Bottom 0.61: J3.4 28.96,65.41 v28.96,57.15
N$19
  Top 0.61: J3.3 28.96,62.99 28.07,62.1 IC2.13
N$20
  Top 0.61: J3.2 31.5,62.99 32.38,62.1 IC2.8
N$21  (via drill 0.61)
  Top 0.61: v31.5,57.15 32.89,55.75 IC2.3
  Bottom 0.61: J3.1 31.5,65.15 v31.5,57.15
N$22  (via drill 0.61)
  Top 0.61: v16.26,57.15 17.65,55.75 IC1.3
  Bottom 0.61: J2.1 16.26,65.15 v16.26,57.15
N$23
  Top 0.61: J2.2 16.26,63.25 17.4,62.1 IC1.8
N$24
  Top 0.61: IC1.13 12.32,62.1 13.72,63.5 J2.3
N$25  (via drill 0.61)
  Top 0.61: v13.72,57.15 12.32,55.75 IC1.18
  Bottom 0.61: J2.4 13.72,65.41 v13.72,57.15
N$27
  Top 1.016: U2.1 16.47,8.15 R8.1 16.13,9.02 16.45,9.34 R9.2
RST  (via drill 0.3, 0.35)
  Top 0.254: S1.4 v5.46,45.4 S1.3
  Top 0.305: 26.01,14.08 U3.13 | 26.01,14.08 26.01,11.21 R3.1 | v2.29,14.99 3.05,14.22 25.87,14.22 26.01,14.08
  Bottom 0.254: ISP1.5 2.29,35.81 2.29,40.13 5.46,43.31 v5.46,45.4
  Bottom 0.305: ISP1.5 2.29,32.77 v2.29,14.99 | v2.29,14.99 2.29,14.86 v2.29,14.99
SCK
  Top 0.203: ISP1.3 2.79,36.83 2.29,36.32 2.29,21.08 2.79,20.57 7.75,20.57 9.53,18.8 20.57,18.8 22.24,20.46 U3.9
SCL
  Top 0.203: U3.18 30.01,15.2 33.02,12.19 R2.1 32.83,10.92 32,10.92 31.5,10.41 31.5,7.87 32,7.37 36.83,7.37 37.34,7.87 37.34,10.16 37.93,10.75 43.26,10.75 46.98,14.48 50.8,14.48 52.07,14.48 52.32,14.73 52.7,15.11 U1.6
SDA
  Top 0.203: U3.19 30.81,14.9 33.27,12.45 35.05,12.45 35.69,11.81 R1.1 43.11,11.11 46.99,14.99 51.05,14.99 51.44,15.37 U1.5
VCC  (via drill 0.3, 0.36, 0.51, 0.61)
  Top 0.203: v7.75,48.9 8.76,48.9 9.91,50.04 9.91,51.44 9.53,51.82 8.38,51.82 8.26,51.94 8.26,52.83 8.64,53.21 IC1.20
  Top 0.305: U3.7 24.89,22.06 | 24.89,22.06 27.22,22.06 v28.45,20.83 | U3.14 26.81,19.19 v28.45,20.83 | U3.24 29.62,19.66 v28.45,20.83 | 24.89,22.06 24.89,25.65 24.49,26.06 | U3.2 24.49,26.06 | 24.49,26.06 25.21,26.78 | 25.21,26.78 U3.44 | 25.21,26.78 25.32,26.67 32.77,26.67 33.21,27.11 U3.34 | R3.2 27.62,9.21 v27.94,8.89
  Top 0.356: R2.2 v34.29,9.21 R1.2 | U1.8 55.24,17.4 54.74,17.91 40.64,17.91 38.89,19.66 U3.24 | IC2.11 24.26,64.64 v23.62,65.28 | v26.16,51.44 24.51,51.44 | 24.51,51.44 24.38,51.44 23.75,52.07 23.75,52.83 24.13,53.21 IC2.20 | IC1.11 v8.51,64.64 | IC3.11 39.37,64.64 v38.86,65.15 | IC3.20 39.37,53.21 39.12,52.96 39.12,52.2 39.5,51.82 v40.77,51.82 40.77,48.13 38.73,46.1 37.59,46.1 36.7,46.99 36.7,52.7 36.2,53.21 IC2.1 | 24.51,51.44 23.75,50.67 23.75,47.75 22.99,46.99 v21.56,46.99 20.95,46.99 20.32,47.62 20.32,50.93 21.59,52.2 21.59,52.96 21.34,53.21 IC1.1
  Top 0.508: IC1.20 v14.99,53.21 IC1.1 | IC2.1 IC2.20 | IC3.20 IC3.1 | Q1.3 32.51,34.8 31.62,35.69 19.3,35.69 v19.18,35.81
  Top 0.61: D2.C v17.78,20.83 | 18.81,5.91 20.89,5.91 21.46,6.48 C9.1 v23.18,10.61 24.57,9.21 R3.2
  Top 1.016: U2.2 18.81,5.91 R8.2 | v19.18,35.81 18.66,36.32 SJ1.2
  Bottom 0.203: v8.51,64.64 8.51,57.66 6.22,55.37 6.22,50.42 v7.75,48.9
  Bottom 0.254: ISP1.2 8.76,39.37 10.79,41.4 17.02,41.4 19.18,39.24
  Bottom 0.305: v27.94,8.89 33.97,8.89 v34.29,9.21
  Bottom 0.356: v26.16,51.44 26.16,61.21 27.3,62.36 27.3,64.64 26.67,65.28 v23.62,65.28 23.24,65.66 20.57,65.66 19.68,64.77 19.68,54.99 17.91,53.21 v14.99,53.21 | v38.86,65.15 41.91,62.1 41.91,56.9 40.77,55.75 v40.77,51.82
  Bottom 0.508: v17.78,20.83 19.18,22.23 v19.18,35.81 19.18,39.24 21.46,41.53 21.46,46.89 v21.56,46.99
  Bottom 0.61: v28.45,20.83 v17.78,20.83 17.78,16 v23.18,10.61

### Text on the board
tPlace: TIDE | LUNAR | CLOCK | EARTH CLOCK | REV0.1 | SCOTT RYAN
bPlace: alleybeacheelctric@gmail.com